# EAGLE board TDAR_VER_88 (EAGLE 6.5.0), part 1 of 2
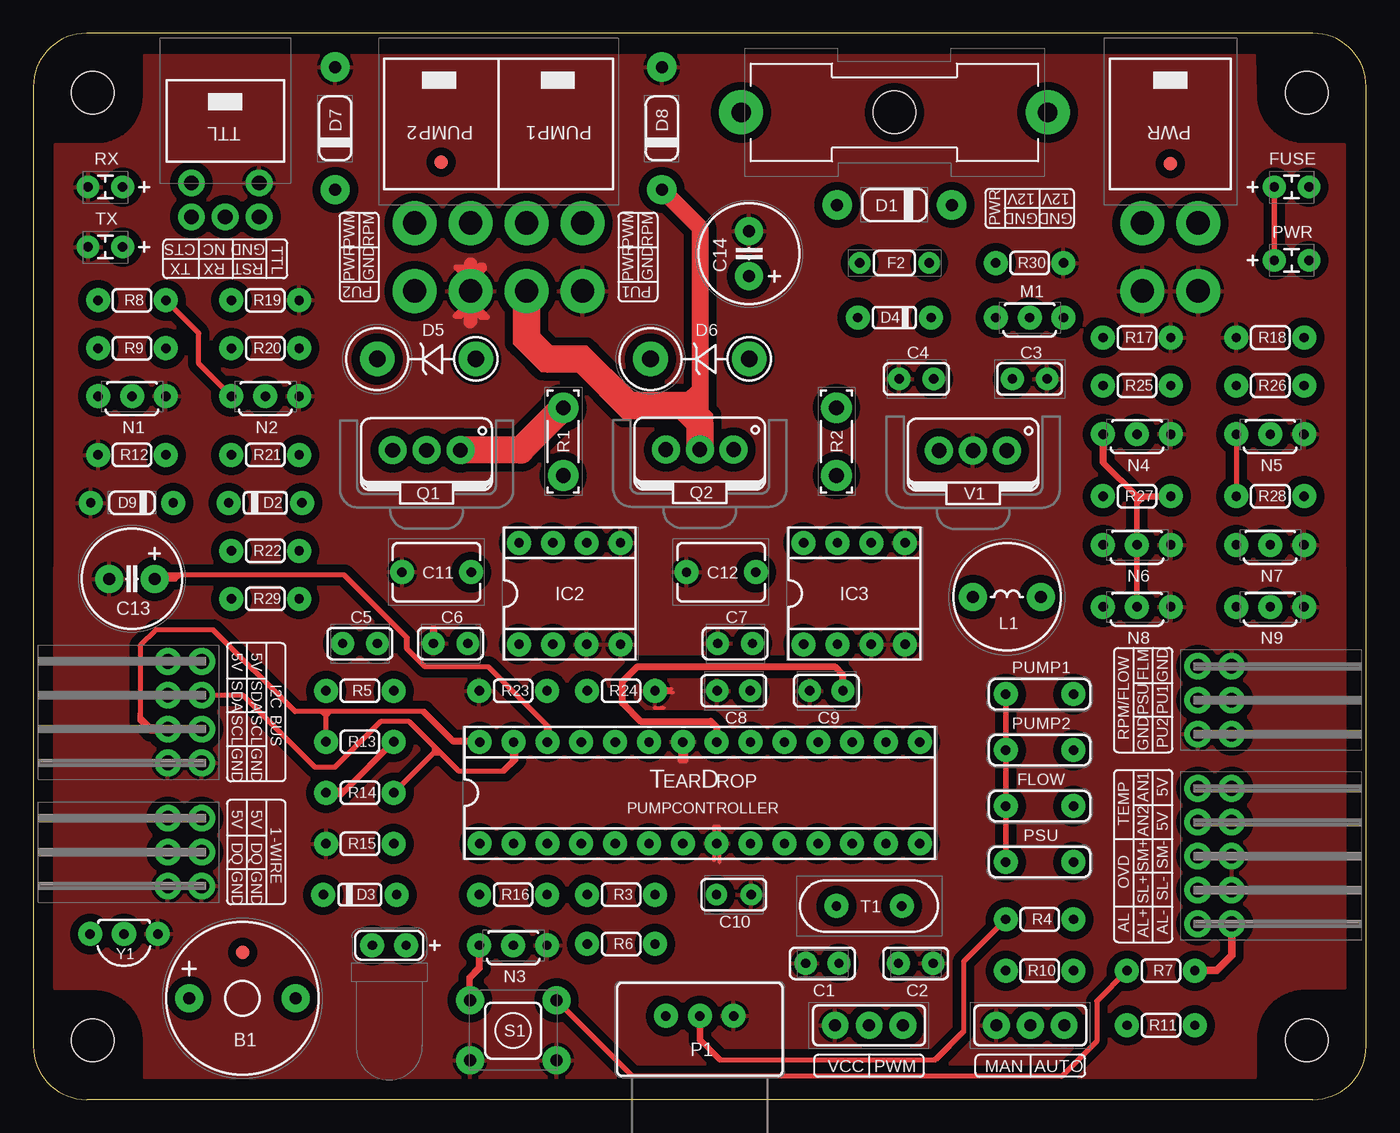
[diagram p1: board, top side]
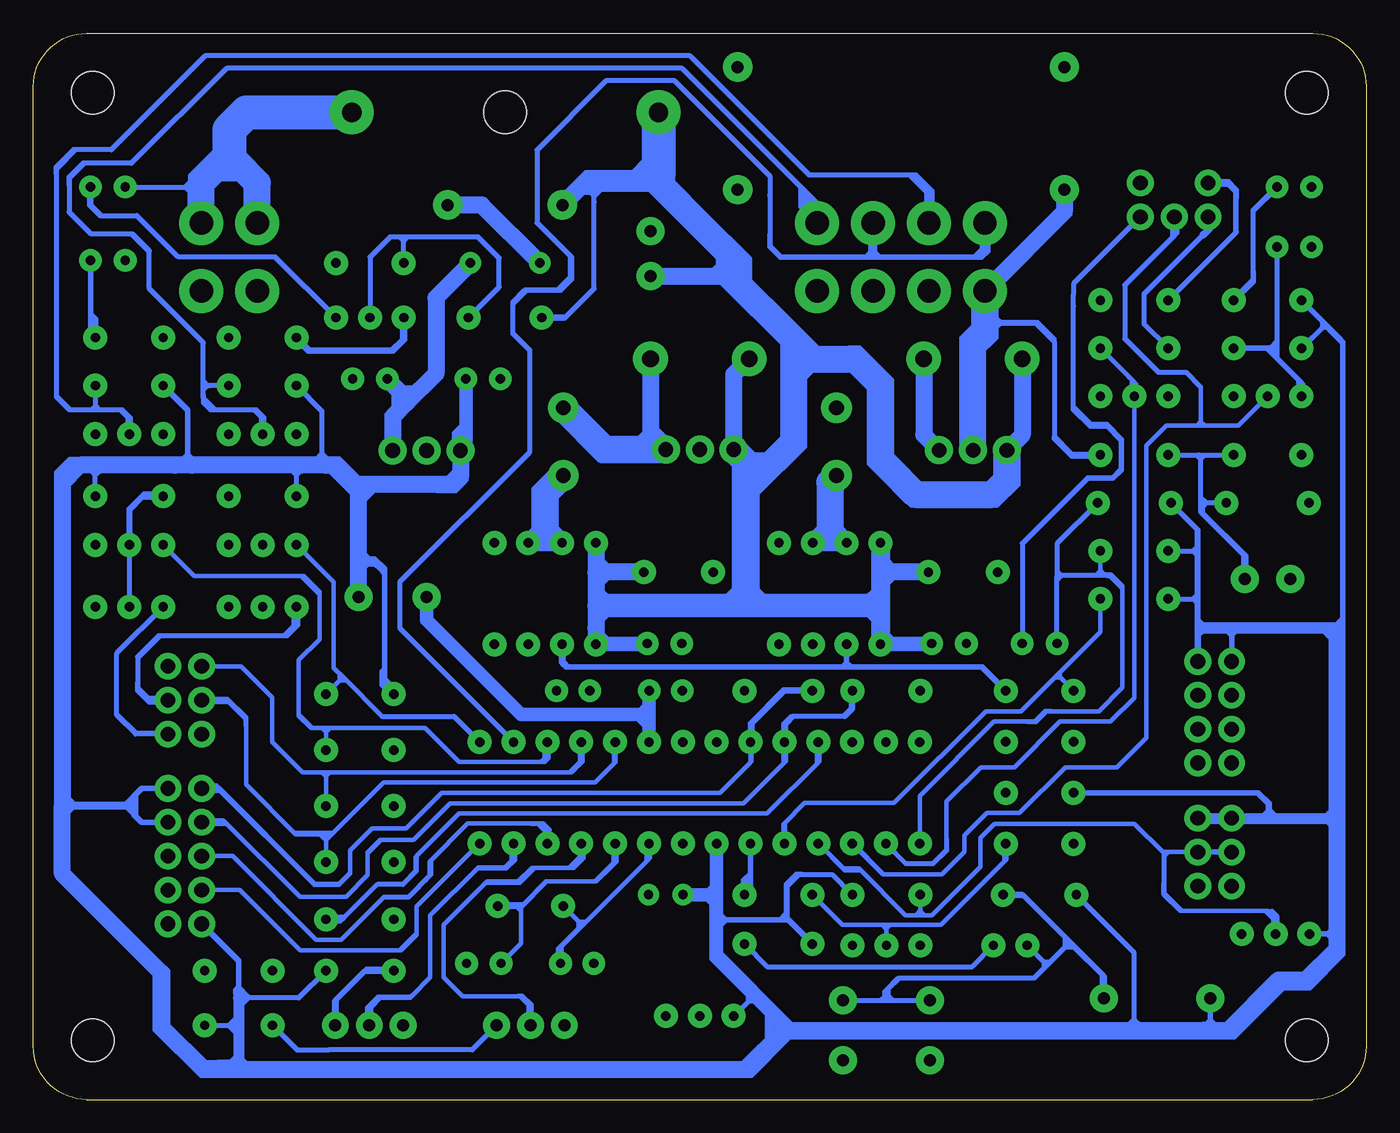
[diagram p2: board, bottom side, seen from below]

Size 100 x 80.01 mm. Coordinates in mm from the lower left corner, seen from the top.
Copper layers (1*16): Top 0.035mm / dielectric 1.5mm / Bottom 0.035mm
Design rules "ITEADstudio_DRC *": minimum track width 6mil, minimum drill 12mil, track to track 12mil, track to pad 12mil, pad to pad 12mil, via to via 12mil, smd to smd 0mil, copper to edge 12mil, drill to drill 12mil, minimum pad ring 10mil, minimum via ring 6mil, stop-mask expansion 2mil, vias tented up to drill 100mil, thermal gap 10mil
Net classes: 0 default: clearance 0.355 mm

## Footprints (pad centres in the part's own frame; a part is rotated, then mirrored left to right if it is on the bottom)
F/TMB = drill 0.9 pad 2.1: + -4,0; - 4,0
MLCC_CERAMIC_12 = drill 0.7 pad 1.7: 1 1.24,0; 2 -1.24,0
MLCC_CERAMIC_11 = drill 0.7 pad 1.7: 1 -1.3,0; 2 1.3,0
MLCC_CERAMIC_8 = drill 0.7 pad 1.7: 1 -1.3,0; 2 1.3,0
MLCC_CERAMIC = drill 0.7 pad 1.7: 1 -1.3,0; 2 1.3,0
MLCC_CERAMIC_7 = drill 0.7 pad 1.7: 1 1.24,0; 2 -1.24,0
MLCC_CERAMIC_6 = drill 0.7 pad 1.6: 1 -1.3,0; 2 1.3,0
WIMA_CAPACITOR = drill 0.7 pad 1.8: 1 -2.6,0; 2 2.6,0
E5-10,5 = drill 0.9 pad 2.1: + -1.7,0; - 1.7,0
UF4004 = drill 0.9 pad 2.2: A 4.3,0; C -4.3,0
DO35-7 = drill 0.7 pad 1.8: A 2.75,0; C -2.75,0
1N4148 = drill 0.7 pad 1.8: A -2.75,0; C 2.75,0
1N4148_2 = drill 0.7 pad 1.8: A -2.75,0; C 2.75,0
TVS_DIODE = drill 1.25 pad 2.6: A 3.7,0; C -3.7,0
UF4004_2 = drill 0.9 pad 2.2: A 4.6,0; C -4.6,0
DO34Z7 = drill 0.7 pad 1.8: A 3.1,0; C -3.1,0
LED_5_HORIZONTAL = drill 0.7 pad 1.8: A 1.27,0; K -1.27,0
FUSE_GLASS = drill 1.45 pad 3.3: 1 11.5,0; 2 -11.5,0 | hole 3.2: 0,0
PTC = drill 0.7 pad 1.6: 1 -2.6,0; 2 2.6,0
FIDUCIAL-1X2 = smd 1 x 1: 1 0,0
RESISTOR_SOCKET_TOP = drill 0.7 pad 1.8: 1 -2.54,0; 2 2.54,0
LED_1.8_LEFT = drill 0.7 pad 1.7: A -1.3,0; K 1.3,0
IO_GENERAL_4 = drill 1.1 pad 2: 5V_1 3.81,5.08; 5V_2 3.81,2.54; ALARM_LED+ 1.27,-5.08; ALARM_LED- 3.81,-5.08; SYSTEM_LED+ 1.27,-2.54; SYSTEM_LED- 3.81,-2.54; SYSTEM_MODE+ 1.27,0; SYSTEM_MODE- 3.81,0; TEMP_AN1 1.27,5.08; TEMP_AN2 1.27,2.54
I0_ONE-WIRE = drill 1.1 pad 2: 5V_1 -1.27,2.54; 5V_2 -3.81,2.54; DQ_1 -1.27,0; DQ_2 -3.81,0; GND_1 -1.27,-2.54; GND_2 -3.81,-2.54
IO_I2C = drill 1.1 pad 2: 5V_1 -1.27,3.81; 5V_2 -3.81,3.81; GND_1 -1.27,-3.81; GND_2 -3.81,-3.81; SCL_1 -1.27,-1.27; SCL_2 -3.81,-1.27; SDA_1 -1.27,1.27; SDA_2 -3.81,1.27
IO_SENSOR_4 = drill 1.1 pad 2: FLOW_A 1.27,2.54; FLOW_B 3.81,2.54; GND 1.27,-2.54; PSU 1.27,0; PUMP_1 3.81,0; PUMP_2 3.81,-2.54
TTL_USB_7 = drill 1.1 pad 2: CTS -2.54,3.81; GND 2.54,3.81; RST 2.54,1.27; RX 0,1.27; TX -2.54,1.27
ATMEGA328P = drill 0.7 pad 1.8: 1 -16.51,-3.81; 2 -13.97,-3.81; 3 -11.43,-3.81; 4 -8.89,-3.81; 5 -6.35,-3.81; 6 -3.81,-3.81; 7 -1.27,-3.81; 8 1.27,-3.81; 9 3.81,-3.81; 10 6.35,-3.81; 11 8.89,-3.81; 12 11.43,-3.81; 13 13.97,-3.81; 14 16.51,-3.81; 15 16.51,3.81; 16 13.97,3.81; 17 11.43,3.81; 18 8.89,3.81; 19 6.35,3.81; 20 3.81,3.81; 21 1.27,3.81; 22 -1.27,3.81; 23 -3.81,3.81; 24 -6.35,3.81; 25 -8.89,3.81; 26 -11.43,3.81; 27 -13.97,3.81; 28 -16.51,3.81
TC4420 = drill 0.7 pad 1.8: 1 -3.81,-3.81; 2 -1.27,-3.81; 3 1.27,-3.81; 4 3.81,-3.81; 5 3.81,3.81; 6 1.27,3.81; 7 -1.27,3.81; 8 -3.81,3.81
IRF24 = drill 0.9 pad 2.1: 1 -2.54,0; 2 2.54,0
ZVP2106A = drill 0.7 pad 1.8: D -2.54,0; G 0,0; S 2.54,0
ZVN2106A = drill 0.7 pad 1.8: D -2.54,0; G 0,0; S 2.54,0
POTENTIMETER_SQUARE = drill 0.7 pad 1.8: 1 -2.54,3.65; 2 0,3.65; 3 2.54,3.65
DP10080_V1 = hole 3.2: 5.25,76.185; 96.35,5.075; 5.25,5.075; 96.35,76.185
MOLEX_4PIN_2 = drill 1.75 pad 3.3: 1 2.1,-9; 2 -2.1,-9; 3 2.1,-14.1; 4 -2.1,-14.1
MOLEX_POWER_8_PIN_HORIZONTAL_2 = drill 1.75 pad 3.3: 12V_A -6.3,-14.1; 12V_B 2.1,-14.1; GND_A -2.1,-14.1; GND_B 6.3,-14.1; PWM_A -6.3,-9; PWM_B 2.1,-9; TACH_A -2.1,-9; TACH_B 6.3,-9
IRF5210 = drill 1.1 pad 2.1: D 0,4.3; G 2.54,4.3; S -2.54,4.3
V234/12 = drill 1.1 pad 2.3: 1 -2.54,0; 2 2.54,0
0204/5 = drill 0.7 pad 1.8: 1 -2.54,0; 2 2.54,0
LED_1.8_RIGHT = drill 0.7 pad 1.7: A 1.3,0; K -1.3,0
MOM_SWITCH_6.0 = drill 0.9 pad 2.1: 1 -3.25,-2.25; 2 3.25,-2.25; 3 -3.25,2.25; 4 3.25,2.25
SLIDING_SWITCH_5 = drill 0.9 pad 2: 1 0,0; 2 -2.54,0; 3 2.54,0
SLIDING_SWITCH_4 = drill 0.9 pad 2: 1 0,0; 2 -2.54,0; 3 2.54,0
CRYSTAL_16MHZ = drill 0.7 pad 1.8: 1 -2.45,0; 2 2.45,0
LM7805 = drill 1.1 pad 2.1: GND 0,4.3; VI 2.54,4.3; VO -2.54,4.3
DS18B20 = drill 0.7 pad 1.8: D 0,0; G -2.54,0; V 2.54,0

## Placement (x,y rotation side)
B1  (12V, 30mA, 2300Hz)  [F/TMB]  15.69,7.61 0 top
C1  22pF/50V  [MLCC_CERAMIC_12]  59.2,10.22 0 top
C2  22pF/50V  [MLCC_CERAMIC_11]  66.2,10.22 0 top
C3  470nF/25V  [MLCC_CERAMIC_8]  74.75,54.08 0 top
C4  100nF/25V  [MLCC_CERAMIC]  66.25,54.08 0 top
C5  100nF/25V  [MLCC_CERAMIC]  24.5,34.23 0 top
C6  100nF/25V  [MLCC_CERAMIC]  31.3,34.23 0 top
C7  100nF/25V  [MLCC_CERAMIC]  52.65,34.23 0 top
C8  100nF/25V  [MLCC_CERAMIC_7]  52.55,30.68 0 top
C9  100nF/25V  [MLCC_CERAMIC_7]  59.5,30.68 0 top
C10  100nF / 25V  [MLCC_CERAMIC_6]  52.55,15.38 0 top
C11  (MKS2B042201F00JSSD)  [WIMA_CAPACITOR]  30.25,39.58 180 top
C12  (MKS2B042201F00JSSD)  [WIMA_CAPACITOR]  51.6,39.58 180 top
C13  100uF/50V  [E5-10,5]  7.4,39.08 180 top
C14  470uF/35V  [E5-10,5]  53.7,63.47 90 top
D1  1N4007  [UF4004]  64.6,67.12 180 top
D2  1N4148  [DO35-7]  17.4,44.77 0 top
D3  1N4148  [1N4148]  24.5,15.38 180 top
D4  1N4148_2  [1N4148_2]  64.6,58.67 0 top
D5  ICTE12-E3/51  [TVS_DIODE]  29.5,55.58 0 top
D6  ICTE12-E3/51  [TVS_DIODE]  50,55.58 0 top
D7  UF4004  [UF4004_2]  22.65,72.88 90 top
D8  UF4004  [UF4004_2]  47.15,72.88 90 top
D9  BZX79-B/C5V1  [DO34Z7]  7.4,44.77 180 top
E1  RED  [LED_5_HORIZONTAL]  26.7,11.57 0 top
F1  6.3A  [FUSE_GLASS]  64.6,74.08 0 top
F2  0.5A/60V  [PTC]  64.6,62.77 0 top
FID1  FIDUCIAL1X2  [FIDUCIAL-1X2]  85.3,70.24 0 top
FID2  FIDUCIAL1X2  [FIDUCIAL-1X2]  15.69,11.07 0 top
FID3  FIDUCIAL1X2  [FIDUCIAL-1X2]  30.59,70.35 0 top
FLOW  10K/0.5W  [RESISTOR_SOCKET_TOP]  75.5,22.02 0 top
FUSE  RED  [LED_1.8_LEFT]  94.4,68.47 0 top
I/O_1  IO_SENSOR  [IO_GENERAL_4]  86.1,18.27 0 top
I/O_2  IO_ONE-WIRE  [I0_ONE-WIRE]  13.9,18.57 0 top
I/O_3  IO_I2C  [IO_I2C]  13.9,29.07 0 top
I/O_4  IO_METER  [IO_SENSOR_4]  86.1,29.98 0 top
I/O_5  TTL_USB  [TTL_USB_7]  14.4,64.97 0 top
IC1  ATMEGA328P  [ATMEGA328P]  50,23.02 0 top
IC2  MIC4421  [TC4420]  40.25,37.98 0 top
IC3  MIC4421  [TC4420]  61.6,37.98 0 top
L1  10uH/4.7A  [IRF24]  73.05,37.73 0 top
M1  ZVP2106A  [ZVP2106A]  74.75,58.67 0 top
N1  ZVN2106A  [ZVN2106A]  7.4,52.77 0 top
N2  ZVN2106A  [ZVN2106A]  17.4,52.77 0 top
N3  ZVN2106A  [ZVN2106A]  36,11.57 0 top
N4  ZVN2106A  [ZVN2106A]  82.8,49.92 0 top
N5  ZVN2106A  [ZVN2106A]  92.8,49.92 0 top
N6  ZVN2106A  [ZVN2106A]  82.8,41.62 0 top
N7  ZVN2106A  [ZVN2106A]  92.8,41.62 0 top
N8  ZVN2106A  [ZVN2106A]  82.8,36.98 0 top
N9  ZVN2106A  [ZVN2106A]  92.8,36.98 0 top
P1  10K  [POTENTIMETER_SQUARE]  50,2.62 0 top
PCB1  80X100mm  [DP10080_V1]  -0.8,-0.62 0 top
POWER  4-PIN MOLEX  [MOLEX_4PIN_2]  85.3,74.78 0 top
PSU  10K/0.5W  [RESISTOR_SOCKET_TOP]  75.5,17.82 0 top
PUMP1  10K/0.5W  [RESISTOR_SOCKET_TOP]  75.5,30.43 0 top
PUMP2  10K/0.5W  [RESISTOR_SOCKET_TOP]  75.5,26.23 0 top
PUMP_2  PUMP2  [MOLEX_POWER_8_PIN_HORIZONTAL_2]  34.9,74.78 0 top
PWR  GREEN  [LED_1.8_LEFT]  94.4,62.98 0 top
Q1  IRF5210PBF  [IRF5210]  29.5,44.42 0 top
Q2  IRF5210PBF  [IRF5210]  50,44.48 0 top
R1  100R/15W  [V234/12]  39.75,49.38 270 top
R2  100R/15W  [V234/12]  60.25,49.38 270 top
R3  470R/0.5W  [0204/5]  44.1,15.38 0 top
R4  470R/0.5W  [0204/5]  75.5,13.53 0 top
R5  560R/0.5W  [0204/5]  24.5,30.68 0 top
R6  560R/0.5W  [0204/5]  44.1,11.68 0 top
R7  560R/0.5W  [0204/5]  84.6,9.68 0 top
R8  1K/0.5W  [0204/5]  7.4,59.98 0 top
R9  1K/0.5W  [0204/5]  7.4,56.38 0 top
R10  1K/0.5W  [0204/5]  75.5,9.68 0 top
R11  1K/0.5W  [0204/5]  84.6,5.58 0 top
R12  4K7/0.5W  [0204/5]  7.4,48.38 0 top
R13  4K7/0.5W  [0204/5]  24.5,26.85 0 top
R14  4K7/0.5W  [0204/5]  24.5,23.02 0 top
R15  4K7/0.5W  [0204/5]  24.5,19.2 0 top
R16  4K7/0.5W  [0204/5]  36,15.38 0 top
R17  4K7/0.5W  [0204/5]  82.8,57.17 0 top
R18  4K7/0.5W  [0204/5]  92.8,57.17 0 top
R19  10K/0.5W  [0204/5]  17.4,59.98 0 top
R20  10K/0.5W  [0204/5]  17.4,56.38 0 top
R21  10K/0.5W  [0204/5]  17.4,48.38 0 top
R22  10K/0.5W  [0204/5]  17.4,41.17 0 top
R23  10K/0.5W  [0204/5]  36,30.68 0 top
R24  10K/0.5W  [0204/5]  44.1,30.68 0 top
R25  10K/0.5W  [0204/5]  82.8,53.58 0 top
R26  10K/0.5W  [0204/5]  92.8,53.58 0 top
R27  10K/0.5W  [0204/5]  82.8,45.27 0 top
R28  10K/0.5W  [0204/5]  92.8,45.27 0 top
R29  270K/0.5W  [0204/5]  17.4,37.58 0 top
R30  270K/0.5W  [0204/5]  74.75,62.77 0 top
RX  ORANGE  [LED_1.8_RIGHT]  5.4,68.47 0 top
S1  MOMENTARY  [MOM_SWITCH_6.0]  36,5.21 0 top
S2  LATCHING  [SLIDING_SWITCH_5]  62.7,5.58 0 top
S3  LATCHING SWITCH  [SLIDING_SWITCH_4]  74.8,5.58 0 top
T1  16MHZ  [CRYSTAL_16MHZ]  62.7,14.53 0 top
TX  YELLOW  [LED_1.8_RIGHT]  5.4,63.97 0 top
U$1  TDPC_LOGO  [TDPC_LOGO]  50,20.77 0 top
U$2  MOLEX_4PIN_LEGEND  [MOLEX_4PIN_LEGEND]  74.75,66.88 0 top
V1  LM7805ACT  [LM7805]  70.5,44.41 0 top
Y1  DS18B20  [DS18B20]  6.8,12.43 180 top

## Tracks (layer width: path | path; a pad name or v marks a point on that pad's centre or on a via)
5V
  Top 0.254: 22.12,23.09 22.37,22.84 23.18,22.84 27.15,26.82 27.15,26.91 27.11,26.95 | 27.11,26.95 26.97,26.95 23.31,23.29 22.04,23.29 21.86,23.11 21.86,22.98 | R13.2 27.04,26.88 27.11,26.95 | R14.1 21.89,23.02 22.15,23.28 | 22.15,23.28 23.27,23.28 | 23.43,23.28 23.46,23.25 23.46,23.17 23.13,22.84 22,22.84 21.87,22.98 21.87,23.09 | 21.87,23.09 22.05,23.28 22.15,23.28 | 21.87,23.09 21.89,23.09 R14.1
  Top 0.406: R14.1 23.21,23.02 R13.2 | PSU.1 FLOW.1 PUMP2.1 PUMP1.1
  Bottom 0.254: 88.04,48.08 88.31,48.34 88.57,48.34 | 88.28,48.08 88.04,48.08 | 77.89,48.01 77.92,48.01 78.27,48.35 78.45,48.35 78.73,48.08 | 78.36,47.89 78.55,48.08 78.73,48.08 | 79.82,47.09 79.94,47.09 | 79.94,47.09 80.23,46.8 80.3,46.8 80.57,47.08 | 79.94,47.09 80.06,47.22 80.26,47.22 | 74.36,46.05 75.31,45.09 75.77,45.09 77.92,47.24 77.92,47.27 77.83,47.35 77.83,47.71 | 77.23,48.1 77.69,48.1 77.83,47.97 77.83,47.71 | 77.23,48.1 75.73,46.6 | 77.23,48.1 77.24,48.12 | 77.24,48.12 88.06,48.12 | 77.83,47.71 77.94,47.6 | 70.23,46.16 69.72,45.65 68.28,45.65 67.45,46.48 67.45,48.23 | 69.09,46.53 68.27,47.35 67.81,47.35 67.96,47.2 67.96,46.73 | 75.01,46.52 75.62,46.52 77.21,48.12 | 77.25,48.12 77.22,48.12 77.21,48.12 | 77.25,48.12 78.45,48.12 78.45,48.1 | 77.21,48.12 77.21,48.1 | 77.24,48.12 77.25,48.12 | 97.83,24 97.63,24 97.47,24.16 97.47,22.52 97.53,22.46 97.53,22.7 97.53,22.71 97.39,22.71 96.82,22.14 96.82,22.04 97.53,21.32 97.81,21.32 | 87.47,47.99 88.07,47.99 | 88.07,47.99 88.14,47.92 87.73,47.92 87.51,47.7 | 87.89,47.92 88.04,48.08 | 88.43,48.51 89.34,47.6 89.37,47.6 | 87.92,48.02 88.35,48.45 88.4,48.45 88.4,48.31 88.41,48.3 | 45.87,7.45 45.93,7.51 | 45.93,7.51 46,7.57 46,7.85 | 46.48,8.1 46.31,8.27 46.22,8.27 46.18,8.22 | 48.87,11.15 49.02,11.15 48.84,10.97 48.73,10.97 | 48.73,11.8 48.9,11.63 49.02,11.76 | 48.62,13.88 48.42,13.88 48.08,13.54 | 48.08,13.54 48.08,13.43 48.39,13.12 | 48.08,13.54 48.2,13.54 48.23,13.51 48.23,13.47 | 11.44,5.62 11.44,5.43 11.6,5.43 11.89,5.72 11.95,5.72 11.99,5.77 | 17.19,5.69 16.88,5.38 16.81,5.38 | 17.19,5.69 17.4,5.91 17.45,5.91 17.84,5.53 | 17.43,5.63 17.25,5.63 17.19,5.69
  Bottom 0.254: 2.29,12.96 2.49,12.96 3.01,12.44 3.01,12.39 2.56,11.95 2.52,11.95 2.43,12.04 2.49,12.09 | 77.6,2.71 77.67,2.71 77.67,2.54 77.94,2.27 | 43.85,13.48 43.92,13.48 43.91,13.47 43.91,13.45 | 43.85,13.48 43.53,13.8 | 43.46,13.47 43.47,13.48 43.85,13.48 | 2.16,35.4 2.19,35.37 2.4,35.37 | 2.03,34.12 1.82,34.12 1.7,34.01 | 1.68,56.43 1.68,34.01 1.7,34.01 | 1.68,56.43 1.68,56.77 | 1.94,35.67 2.02,35.67 | 2.02,35.67 12.54,35.67 | 12.67,35.27 12.49,35.09 2.4,35.09 2.68,34.81 | 2.68,34.81 2.68,35.27 2.62,35.33 3.03,35.33 3.2,35.16 | 3.2,35.16 3.06,35.16 2.57,34.66 | 2.68,34.56 3.03,34.91 | 3.03,34.91 3.23,35.12 | 3.2,35.16 3.03,34.98 3.03,34.91 | 2.69,34.69 2.56,34.81 2.49,34.75 2.4,34.75 | 2.77,57.83 2.85,57.91 3.23,57.91 | 3.23,57.91 3.16,57.98 | 3.16,57.98 3.16,58.27 | 3.41,58.53 3.41,58.55 3.35,58.49 3.35,58.02 | 3.35,58.02 3.35,57.87 | 3.16,58.27 | 3.16,58.27 3.16,58.28 | 2.02,35.67 2.02,35.62 1.97,35.62 1.93,35.66 1.93,36.02 1.75,36.2 1.76,36.2 2.53,35.44 2.53,35.37 2.4,35.37 | 3.16,57.98 3.03,58.1 3.03,58.15 | 3.23,57.91 3.35,58.02 | 9.59,35.17 9.68,35.17 10.06,34.8 10.15,34.8 10.44,35.09 12.31,35.09 12.59,34.8 | 12.59,34.8 12.59,35.63 12.71,35.76 12.71,35.88 | 12.71,35.88 12.71,36.06 12.67,36.1 12.67,36.02 12.28,35.62 | 12.66,37.99 12.98,37.67 | 12.98,37.67 12.98,37.48 12.74,37.23 | 12.98,37.67 12.96,37.66 12.88,37.66 12.88,37.58 | 12.69,41.6 12.69,41.55 13.03,41.2 13.03,41.12 12.88,40.97 | 12.88,40.97 12.75,40.84 | 12.67,41.09 12.79,40.97 12.88,40.97 | 44.02,5.62 44.15,5.62 44.75,6.21 44.8,6.17 | 44.02,5.62 43.86,5.62 43.82,5.66 43.82,5.75 44.47,6.41 44.47,6.74 43.27,5.54 43.01,5.54 43.01,5.58 43.2,5.78
  Bottom 0.254: 44.02,5.62 44.57,6.17 | 44.8,6.17 44.92,6.04 44.92,5.72 | 2.18,34.1 2.21,34.08 2.3,34.08 1.96,34.41 1.96,34.47 | 2.4,34.75 2.17,34.75 2.17,35.04 | 2.36,32.63 2.68,32.95 2.68,34.56 | 2.68,34.56 2.68,34.81 | 2.66,21.73 2.99,21.39 2.99,20.86 2.54,20.41 2.37,20.41 2.41,20.45 2.41,20.46 2.18,20.46 | 6.95,21.23 6.95,21.39 | 7.26,21.7 7.32,21.7 7.36,21.66 | 7.26,21.7 7.28,21.73 7.28,21.95 | 45.33,7.45 44.87,7.45 43.2,5.78 | 95.64,47.76 95.99,48.1 97.31,48.1 | 98.33,45.97 98.14,46.16 98.14,46.27 | 98.14,46.27 98.14,47.02 97.24,47.92 96.84,47.92 | 97.83,46.27 98.14,46.27 | 98.03,45.58 98.33,45.88 98.33,45.97 | 98.33,45.97 98.33,47.09 97.31,48.1 | 97.31,48.1 97.31,48.11 95.9,48.11 97.9,46.1 98.12,46.1 98.34,46.33 98.34,47.07 98.13,47.28 | 95.39,46.81 95.32,46.81 94.94,47.2 94.94,47.32 95.12,47.51 | 95.39,46.81 95.67,47.08 | 88.41,47.95 88.41,47.91 88.12,47.62 | 88.07,47.99 88.07,47.66 | 88.07,47.66 88.12,47.62 | 88.12,47.62 88.1,47.6 | 88.04,48.08 88.04,47.7 88.07,47.66 | 2.11,33.87 2.24,34 | 2.24,34 2.61,34 2.68,34.08 2.68,34.53 2.5,34.71 1.8,34.71 2.04,34.95 2.5,34.95 2.42,35.04 2.17,35.04 | 2.17,35.04 1.99,35.04 | 1.68,35.41 1.68,36.13 1.76,36.13 | 2.4,35.56 1.83,36.13 1.76,36.13 | 2.4,35.37 2.4,35.39 | 1.76,34.97 2.4,34.97 | 2.4,34.97 2.4,35.37 | 2.4,34.75 2.4,34.97 | 2.17,35.08 2.17,35.04 | 2.68,34.56 2.4,34.56 2.4,34.75 | 2.24,34 1.7,34 1.7,34.01 | 1.76,36.13 1.76,36.06 | 1.76,56.5 1.68,56.58 1.68,56.78 | 1.67,56.88 1.67,56.68 1.8,56.56 1.68,56.43 | 1.67,56.88 2.33,57.53 2.58,57.53 3.01,57.97 | 4.65,56.67 4.46,56.67 3.25,57.88 3.2,57.88 | 3.2,57.88 2.94,57.88 1.83,56.76 | 3.23,57.91 3.2,57.88 | 4.57,8.46 6.37,8.46 10.14,4.7 12.13,4.7 12.81,5.38 16.7,5.38 16.81,5.38
  Bottom 0.254: 1.67,56.87 1.67,11.1 4.31,8.46 4.57,8.46 | 1.67,56.87 1.9,57.1 | 1.67,56.88 1.67,56.87 | 46.05,7.85 46,7.85 | 46,7.85 45.27,7.85 43.2,5.78 | 43.03,5.6 43.2,5.78 | 43.2,5.78 | 12.66,33.11 12.71,33.11 12.73,33.13 12.73,34.69 12.63,34.79 12.6,34.79 12.59,34.8 | 94.55,47.42 94.66,47.42 95.15,46.92 | 95.15,46.92 95.36,46.72 | 95.39,46.81 95.28,46.92 95.15,46.92 | 46.32,8.04 46.36,8 46.36,7.42 46.34,7.4 | 46.34,7.4 45.86,7.4 45.93,7.47 45.93,7.51 | 48.96,11.22 48.99,11.22 48.84,11.38 48.76,11.38 | 49.11,10.62 49.11,11.51 48.96,11.66 49.02,11.72 49.02,11.76 | 49.11,10.62 44.73,6.24 44.73,6.21 44.77,6.17 44.8,6.17 | 48.76,11.38 48.73,11.38 | 43.67,13.51 43.59,13.43 43.21,13.43 43.4,13.62 43.4,13.82 43.49,13.92 43.49,13.99 43.95,13.53 43.99,13.53 43.91,13.45 | 43.91,13.45 43.66,13.45 | 8.32,22.98 8.27,23.02 8.34,23.09 | 8.75,23.01 8.67,23.09 8.34,23.09 | 8.34,23.09 8.2,23.09 | 6.97,21.47 7.21,21.7 7.26,21.7 | 49.03,14.64 49.45,15.06 49.45,15.71 49.03,16.13 48.88,16.13 48.73,15.98 48.73,15.56 | 11.11,5.43 11.11,5.5 11.64,6.02 11.74,6.02 11.99,5.77 | 11.99,5.77 12.08,5.68 | 75.28,39.57 75.28,39.73 74.88,40.13 74.38,40.13 74.01,39.77 | 74.01,39.77 73.71,39.46 | 73.68,38.48 73.58,38.58 73.58,39.88 73.65,39.96 | 73.65,39.96 74.34,40.65 74.77,40.65 75.14,41.02 | 74.01,39.77 73.65,39.77 73.65,39.96 | 91.99,23.23 92.23,22.99 | 92.23,22.99 92.23,21.31 92.87,21.95 92.89,21.95 92.89,22.23 92.48,22.64 92.45,22.61 92.45,22.09 | 91.91,20.96 92.1,20.96 93.1,21.96 93.1,22.21 92.38,22.93 92.29,22.93 92.23,22.99 | 44.89,4.53 44.98,4.62 44.98,6.66 44.8,6.47 44.8,4.94 44.57,5.16 44.57,6.47 44.69,6.36 44.78,6.36 44.3,5.88 44.3,5.66 49.17,10.53 49.17,11.61
  Bottom 0.254: 49.17,11.61 49.17,14.65 49.89,15.37 | 49.02,11.76 49.02,12.19 | 49.11,10.62 48.85,10.87 48.85,11.61 49.17,11.61 | 41.79,5.4 42.77,5.4 48.76,11.39 48.76,11.38 | 48.76,11.35 48.76,11.38 | 45.8,7.43 45.9,7.33 46.3,7.33 | 46.3,7.33 46.42,7.45 46.42,7.85 | 46.34,7.4 46.3,7.36 46.3,7.33 | 41.94,16.84 42.21,16.84 42.33,16.96 42.77,16.96 43.56,16.17 43.56,14 44.03,13.52 43.36,13.52 | 43.36,13.52 43.31,13.47 | 43.36,13.52 43.39,13.55 43.39,16.09 42.67,16.81 | 1.9,12.2 1.67,11.97 1.67,10.86 4.2,8.33 4.7,8.33 | 4.7,8.33 6.19,8.33 9.86,4.66 43.98,4.66 44.09,4.77 | 4.57,8.46 4.7,8.33 | 50.3,2.22 49.84,1.76 46.6,1.76 | 46.6,1.76 46.09,1.76 43.26,4.59 | 46.6,2.27 46.47,2.41 46.47,1.9 46.6,1.76 | 75.41,44.63 75.41,44.65 74.35,45.7 74.58,45.7 77.01,48.14 78.42,48.14 78.45,48.1 | 78.45,48.1 78.52,48.03 | 77.72,47.73 77.72,47.91 78.27,48.46 78.45,48.46 78.83,48.08 78.82,48.08 78.73,48.08 | 73.65,31.12 73.63,31.1 73.61,31.1 | 72.91,30.35 72.91,30.4 72.77,30.54 72.77,30.82 73.59,31.63 73.59,31.35 72.78,30.54 72.78,30.35 72.88,30.25 73.06,30.25 73.19,30.38 | 73.19,30.38 73.9,31.09 73.9,32.17 73.71,32.36 | PUMP1.1 73,30.38 73.19,30.38 | 48.65,13 48.42,13 48.12,13.29 | 48.12,13.29 48.01,13.41 48.01,13.53 48.45,13.98 | 48.08,13.54 48.12,13.5 48.12,13.29 | 8.17,21.14 7.93,21.14 7.32,21.75 7.32,21.95 7.22,22.05 7.22,22.23 | 7.22,22.23 8.06,23.08 9.05,23.08 8.97,23 8.22,23 7.36,22.14 7.36,21.66 | 7.36,21.66 7.36,21.22 | 11.52,35.35 11.94,35.35 12.57,35.97 12.57,42.77 14.45,44.66 14.57,44.66 14.57,44.6 12.73,42.77 12.73,34.88 | 12.73,34.88 12.73,32.87 12.68,32.82 12.6,32.82 12.52,32.9 12.52,34.81 12.2,35.13
  Bottom 0.254: 12.59,34.8 12.66,34.8 12.73,34.88 | 11.94,35.52 12.05,35.52 12.62,36.09 12.62,35.97 12.71,35.88 | 6.57,21.04 6.57,21.13 7.21,21.77 7.21,22.22 | 7.21,22.22 7.21,22.25 8.05,23.1 21.98,23.1 22.05,23.03 22.05,23.01 22,22.95 8.22,22.95 7.4,22.14 7.4,21.71 7.86,21.26 7.94,21.26 | 7.22,22.23 7.21,22.22 | 84.2,2.27 84.15,2.32 84.12,2.32 83.97,2.47 83.84,2.47 83.84,2.62 84.6,3.37 84.73,3.37 86.36,1.75 87.45,1.75 90.92,5.21 90.92,9.55 91.34,9.97 | 86.44,2.34 86.43,2.35 86.2,2.35 | 91.76,10.87 91.05,10.87 89.83,9.65 89.83,5.63 86.91,2.71 87.2,2.42 87.2,2.35 | 68.19,48.43 68.05,48.28 68.05,48.25 68.03,48.24 67.98,48.24 67.45,48.77 67.45,49.46 67.17,49.74 | 68.19,48.43 68.47,48.7 68.47,50.06 67.86,50.67 67.86,50.37 68.22,50.01 68.22,49.3 68.27,49.26 68.23,49.26 68.07,49.42 68.07,50.07 68.11,50.1 | 68.19,48.43 67.96,48.66 V1.VO 67.96,50.2 67.55,50.62 | 67.17,49.74 67.17,51.34 67.37,51.14 67.37,49.73 67.62,49.48 67.62,49.23 67.59,49.27 67.59,50.18 67.65,50.11 67.8,50.11 67.81,50.1 67.81,49.25 67.64,49.09 67.64,48.69 67.17,49.16 67.17,49.38 | 67.17,49.38 67.17,49.74 | 67.86,48.73 67.4,49.2 67.37,49.2 67.4,49.22 67.4,49.5 67.29,49.5 67.17,49.38 | 17.89,5.65 17.48,6.06 17.39,6.06 16.81,5.49 16.81,5.38
  Bottom 0.305: 6.95,21.39 7.03,21.48 7.28,21.48
  Bottom 0.356: 7.28,21.11 7.33,21.16 9.93,21.16 9.97,21.11
  Bottom 0.381: 2.6,11.97 2.49,12.09 2.24,12.34 | 2.24,12.34 2.18,12.39 | 78.04,2.52 78.29,2.27 | R25.1 78.36,51.67 78.36,47.89 78.07,47.6 | R27.1 80.26,47.22 80.26,47.37 80.49,47.6 | 46.18,7.85 46.18,8.22 | 48.73,13.14 48.4,13.47 48.23,13.47 | R14.1 8.27,23.02 8.15,23.02 7.28,22.16 7.28,21.95 7.28,21.48 7.28,21.11 | 17.43,5.63 17.43,11.05 D3.C | 11.89,5.46 12.15,5.21 | 2.33,12.43 2.24,12.34 | R16.2 40.06,16.89 42.58,16.89 42.67,16.81 43.46,16.02 43.46,13.47 | D2.C 12.67,42.8 12.67,41.09 | 12.67,41.09 12.67,37.48 | 12.67,37.48 12.67,36.1 12.67,35.27 | 12.67,35.27 12.67,34.94 | 12.67,34.94 12.67,34.27 | R22.1 12.75,41.17 12.67,41.09 | 12.63,35.31 12.63,34.98 12.67,34.94 | 12.63,35.34 12.63,35.31 | 12.63,35.31 12.67,35.27 | R29.1 12.88,37.58 12.76,37.58 12.67,37.48 | 2.03,34.12 2.16,34.12 2.18,34.1 | R9.1 3.16,58.08 3.16,58.27 | R28.2 95.34,47.29 95.12,47.51 95.03,47.6 | R8.1 1.9,57.01 1.9,56.95 | P1.1 46.23,7.51 45.93,7.51 | 86.44,2.34 86.51,2.27 | R10.2 80.09,7.62 84.6,7.62 84.6,7.63 | R11.2 84.64,5.58 | 84.64,5.58 84.6,5.53 | 84.64,4.88 85.3,5.55 85.3,5.57 84.74,6.13 84.73,6.13 84.73,6.78 83.88,7.63 83.88,7.73 84.6,8.45 84.83,8.22 84.83,5.76 | 84.83,5.76 84.83,5.61 | 84.64,5.58 84.83,5.76
  Bottom 0.406: 88.41,47.95 88.41,48.3 88.41,51.73 R26.1 | Y1.V 2.33,12.43 | 48.23,13.47 43.46,13.47 43.36,13.47 R6.1 | I/O_3.5V_2 10.09,35.32 10.02,35.39 | I/O_3.5V_1 12.63,35.34 | 1.76,34.97 1.76,36.06 1.76,56.5 1.76,56.81 1.9,56.95 2.77,57.83 | B1.+ 11.69,5.34 | 11.8,5.21 11.69,5.31 11.69,5.34 | 11.69,5.34 11.6,5.43 | 75.59,40.5 75.52,40.43 74.32,40.43 73.65,39.77 73.65,31.12 PUMP1.1 | I/O_1.5V_2 91.85,20.82 92.45,21.41 92.45,22.09 92.45,22.75 91.85,23.36 I/O_1.5V_1 | I/O_1.ALARM_LED+ 84.6,10.43 84.6,8.04
  Bottom 0.607: 92.45,22.09 97.81,22.09 97.83,22.07
  Bottom 0.813: 12.38,35.39 10.02,35.39 2.4,35.39 2.2,35.39 | 97.64,23.5 97.83,23.7 | I/O_2.5V_1 I/O_2.5V_2 9.97,21.11 2.28,21.11 2.18,21.02 | 84.6,8.04 84.6,7.63 84.6,5.53 84.6,2.35
  Bottom 1.016: 2.26,20.61 2.18,20.7 | IC1.7 48.73,15.56 | 48.73,15.56 48.73,13.14 48.73,11.8 48.73,11.38 48.73,10.97 48.73,10.78 46.18,8.22 44.93,6.97 | 48.73,15.56 48.91,15.38 C10.1 | C4.2 67.55,50.62
  Bottom 1.27: 86.63,2.27 86.51,2.27 84.2,2.27 78.29,2.27 77.94,2.27 46.6,2.27 43.66,5.21 | 2.18,34.1 2.18,21.02 2.18,20.7 2.18,20.46 2.18,12.39 2.18,11.31 4.52,8.97 6.59,8.97 10.36,5.21 11.8,5.21 12.15,5.21 43.66,5.21 | V1.VO 67.96,46.73 68.54,46.16 70.23,46.16 75.89,46.16 | 75.89,46.16 76.04,46.16 77.48,47.6 77.94,47.6 78.07,47.6 80.49,47.6 88.1,47.6 89.37,47.6 95.03,47.6 96.51,47.6 97.83,46.27 97.83,24 97.83,23.7 97.83,22.07 97.83,16.96 90.35,9.48 90.35,5.41 87.29,2.35 87.2,2.35 86.2,2.35 84.6,2.35 | L1.2 75.59,40.5 75.59,45.85 75.89,46.16 | 43.86,5.62 43.66,5.42 43.66,5.21
12V
  Bottom 0.254: 57.79,37.08 57.6,37.08 | 57.6,37.08 57.22,37.08 | 46.54,37.92 46.57,37.89 46.57,37.08 | 60.34,67.09 60.34,67.63 58.5,69.47 | 58.5,69.47 58.35,69.62 | 58.29,69.62 54.2,69.62 | 54.2,69.62 53.6,69.62 | 56.36,68.64 57.33,68.64 57.95,68.02 58.63,68.02 58.8,68.19 58.4,68.19 | 58.23,68.19 58.05,68.19 | 58.05,68.19 58.04,68.18 | 58.4,68.19 58.24,68.03 57.95,67.75 57.95,67.62 57.92,67.66 57.92,67.73 | 57.25,69.36 57.51,69.61 58.38,69.61 | 58.38,69.61 60.68,67.32 | 60.68,67.32 60.68,67.15 | 58.35,69.62 58.38,69.62 | 58.38,69.62 58.38,69.61 | 58.05,68.11 57.76,68.4 53.8,68.4 | 58.05,68.19 58.05,68.11 | 58.05,68.11 58.08,68.08 | 48.97,64.7 47.76,64.7 46.84,63.78 46.84,62.02 | 46.84,62.02 46.98,61.88 47.47,61.88 47.8,61.88 48.2,61.88 48.35,61.73 48.38,61.73 48.58,61.93 48.64,61.93 49.01,62.3 | 48.57,62.79 48.57,62.74 49.01,62.3 | 49.01,62.3 49.1,62.21 | 46.84,62.02 46.75,62.02 | 46.75,62.02 46.7,61.98 46.66,62.01 46.56,62.01 46.56,63.26 46.55,63.27 46.48,63.27 46.37,63.16 46.37,61.48 46.21,61.31 46.21,63.14 48.47,65.39 49.55,65.39 | 39.38,55.87 38.79,56.46 37.99,56.46 35.55,54.02 35.55,47.66 35.79,47.42 35.81,47.42 35.88,47.5 | 27.02,48.67 26.98,48.7 | 26.98,48.7 26.17,48.7 26.07,48.6 26.07,46.12 27.66,44.53 34.16,44.53 37.33,47.7 37.33,53.62 37.73,54.02 | 26.98,48.7 26.98,48.2 26.96,48.17 | 42.86,52.57 42.09,53.34 42.09,54.07 41.5,54.66 38.58,54.66 38.62,54.7 42.3,54.7 42.08,54.49 41.83,54.49 41.86,54.52 41.86,55.21 41.49,55.58 | 44.86,48.24 45.01,48.38 45.95,48.38 45.78,48.21 45.37,48.21 45.9,47.67 | 45.9,47.67 46.17,47.41 46.93,47.41 47.05,47.28 | 47.05,47.28 47.05,46.37 46.99,46.44 46.95,46.44 46.92,46.46 46.92,46.66
  Bottom 0.254: 46.92,47.02 46.92,46.66 | 46.92,46.66 47.45,46.13 47.45,38.36 48.07,37.74 47.82,37.74 47.58,37.98 45.71,37.98 45.34,37.6 45.13,37.6 45.03,37.7 45.07,37.7 45.82,38.45 45.81,38.45 45.8,38.46 44.61,37.28 44.51,37.28 | 56.45,37.7 56.89,37.7 57.48,38.3 57.48,37.16 | 57.48,37.16 56.94,36.61 56.94,36.36 57.45,35.85 | 57.48,37.16 57.52,37.16 57.6,37.08 | 36.66,38.29 36.94,38.29 37.48,37.75 37.48,36.98 | 37.48,36.98 37.48,36.39 36.95,35.87 | 37.4,37.08 37.4,37.06 37.48,36.98 | 45.67,46.99 45.74,47.06 45.74,47.38 | 45.74,47.38 45.74,47.51 45.9,47.67 | 44.15,49.07 44.79,48.44 46.93,48.44 47.45,47.91 47.45,45.77 47.25,45.97 47.25,47.28 47.05,47.28 | 42.09,54.92 42.09,48.97 43.73,47.33 45.7,47.33 45.74,47.38 | 35.43,39.77 35.43,40.05 35.92,40.55 35.92,39.65 35.85,39.58 | 35.85,39.58 35.42,39.14 35.42,39.1 35.92,38.61 | 36.18,39.58 35.85,39.58 | 52.94,37.54 52.94,37.57 53.25,37.26 53.65,37.26 53.74,37.17 54.1,37.17 | 54.2,37.08 54.27,37.08 54.93,37.74 55.09,37.74 | 57.72,67.89 57.88,67.72 57.88,67.61 57.92,67.61 57.92,67.38 | 57.72,67.89 57.12,68.48 | 33.77,34.6 32.45,34.6 32.23,34.38 32.23,34.06 32.51,33.78 32.8,33.78 32.91,33.89 32.91,34.09 32.73,34.09 32.66,34.16 | 33.77,34.6 34.06,34.31 | 33.29,34.48 33.41,34.6 33.77,34.6 | 33.77,34.6 35.92,34.6 | 33.77,34.6 | 54.51,34 54.3,33.79 53.81,33.79 53.57,34.03 53.57,34.37 53.78,34.59 56.8,34.59 | 56.8,34.59 57,34.59 57.13,34.72 | 56.71,34.42 56.8,34.5 56.8,34.59 | 57.46,40.49 57.25,40.49 56.95,40.19 56.95,38.98 57.25,38.69 57.25,38.16 56.92,37.83 57.41,37.83 57.69,38.1 57.69,38.25 56.87,39.07 56.97,39.07 57.78,38.26 57.78,36.18 57.45,35.85
  Bottom 0.254: 56.79,36.42 57.38,35.83 57.43,35.83 57.45,35.85 | 58.79,68.61 58.79,68.33 58.09,68.33 58.23,68.19 | 58.23,68.19 58.4,68.19 | 58.03,69.53 58.12,69.62 58.56,69.62 60.7,67.47 60.7,67.42 | 60.7,67.42 60.61,67.32 | 60.68,67.32 60.7,67.34 60.7,67.42 | 58.15,69.48 58.29,69.62 | 58.29,69.62 58.35,69.62 | 58.38,69.62 58.54,69.62 | 58.54,69.62 60.75,67.41 | 58.54,69.62 58.5,69.58 58.5,69.47 | 46.75,62.02 47.17,62.44 47.17,63 47.15,63.01 47.15,63.04 46.99,63.04 46.68,63.35 | 47.53,63.68 47.2,63.36 46.67,63.36 46.68,63.35 | 46.68,63.35 46.68,62.24 | 58.65,68.69 58.23,68.28 | 58.23,68.28 58.19,68.24 53,68.24 | 58.23,68.19 58.23,68.28 | 61.86,58.65 61.86,58.68 61.9,58.72 61.82,58.8 61.72,58.8 | 61.72,58.8 60.03,58.8 59.98,58.75 59.98,58.71 60.13,58.56 61.87,58.56 61.92,58.62 61.92,58.7 61.83,58.8 | D4.A 61.72,58.8 | 53.35,69.04 53.2,69.04 | 53.2,69.04 53.13,69.04 | 56.43,69.44 56.43,69.28 56.2,69.04 | 60.34,66.92 60.34,67.09 | 60.34,67.09 D1.A | 50.8,66.88 50.8,67.75 51.96,68.91 51.96,70.67 54.02,70.67 55.19,69.49 54.95,69.49 54.3,70.14 54.3,69.89 | 54.3,69.89 54.61,69.59 | 54.3,69.89 54.3,69.72 54.2,69.62 | 57.81,67.94 57.81,67.99 | 57.65,68.17 57.81,68.01 57.81,67.99 | 57.81,67.99 57.72,67.89 | 53.1,69.28 53.1,69.14 53.2,69.04
  Bottom 0.305: 56.71,34.07 56.71,34.42 57.67,35.38 57.79,35.38 | 35.28,34.37 35.3,34.37 35.99,35.06 36.3,34.74 36.3,34.72 36.44,34.72
  Bottom 0.381: 57.92,69.04 57.92,67.73 57.92,67.38 57.92,60.86 60.11,58.67 D4.A
  Bottom 1.016: C7.2 54.01,34.16 IC3.1 | C6.2 32.66,34.16 IC2.1
  Bottom 1.27: D5.C 25.8,49.88 Q1.S | 53.35,69.04 56.2,69.04 57.92,69.04 58.38,69.04 D1.A | IC3.8 57.79,39.52 | 57.79,39.52 57.79,37.08 57.79,35.38 IC3.1 | D6.C 47.46,54.41 Q2.S | C11.1 36.18,39.58 36.44,39.83 | 54.1,37.17 54.2,37.08 | C12.1 57.74,39.58 57.79,39.52 | C14.+ 47.57,61.77 47.47,61.88
  Bottom 1.422: IC2.8 36.44,39.83 36.44,37.01 | 36.44,37.01 36.44,34.72 IC2.1 36.38,34.23 | 37.4,37.08 37.24,37.08 37.17,37.01 36.44,37.01 | 57.73,34.23 IC3.1
  Bottom 1.778: 57.22,37.08 54.2,37.08 46.57,37.08 37.4,37.08
  Bottom 2.032: 53.35,69.04 47.8,63.49 47.8,61.88 42.98,57.06 | 42.98,57.06 42.98,49.33 45.32,46.99 | 45.32,46.99 46.54,45.77 46.54,37.92 46.4,37.77 | 42.98,57.06 41.49,55.58 38.37,55.58 36.45,53.65 36.45,48.07 35.88,47.5 33.8,45.42 28.04,45.42 26.96,46.5 26.96,48.17 Q1.S | Q2.S 45.67,46.99 45.32,46.99
  Bottom 2.54: F1.2 53.1,69.28
ALARM_LED-
  Top 0.254: 87.09,9.72 87.09,9.77 87.14,9.81 | 87.05,9.63 87.12,9.55 88.87,9.55 90.07,10.75 90.07,13.24 90.02,13.29 89.87,13.29 89.76,13.18 89.76,10.92 88.71,9.87 87.19,9.87 87.14,9.81 | R7.2 87.14,9.81
  Top 0.406: I/O_1.ALARM_LED- 89.91,10.83 88.75,9.68 R7.2
ALARM_OUT
  Bottom 0.254: R3.2 46.64,15.81 46.7,15.88
  Bottom 0.406: IC1.6 46.19,15.82 R3.2 | 46.7,15.37 46.7,15.88 46.7,16.44 46.21,16.93 46.21,16.13 46.52,15.81 46.52,16.26 46.44,16.34
CRYSTAL_A
  Bottom 0.254: 58.47,13.38 58.89,13.38 | 58.89,13.38 59.02,13.38 59.05,13.35 59.05,12.87 59.08,12.84 59.08,13.24 59.05,13.28 | 58.82,13.05 58.89,13.12 58.89,13.38 | 54.2,17.74 54.02,17.92 54.02,19.1 53.85,19.27 53.81,19.27 | 53.81,19.27 53.68,19.13 53.68,18.13 54.17,17.64 | 54.02,19.26 53.81,19.26 | 53.81,19.26 53.76,19.26 53.69,19.19 | IC1.9 53.81,19.26 | 53.81,19.26 53.81,19.27 | 60.52,10.19 60.66,10.33 60.66,11.37 59.13,12.9 59.13,13.36 58.93,13.16 58.93,12.88 60.32,11.49 60.32,10.28 60.4,10.19 60.58,10.19 60.65,10.27 | 60.51,10.18 60.52,10.19 | 60.52,10.19 60.52,10.21 60.51,10.22 C1.1 60.44,11.32 60.5,11.38
  Bottom 0.356: IC1.9 53.81,18.07 58.82,13.05 | 58.82,13.05 60.5,11.38 | T1.1 58.82,13.1 58.82,13.05
CRYSTAL_B
  Bottom 0.254: 63.44,14.04 63.44,14.2 63.68,14.44 65.14,14.44 65.2,14.51 65.2,14.55 65.13,14.62 63.29,14.62 63.16,14.75 63.16,14.66 63.38,14.44 | 63.38,14.44 63.38,13.87 63.4,13.84 63.4,14.1 63.73,14.43 | 63.41,14.43 63.44,14.41 63.47,14.41 63.44,14.44 63.38,14.44 | 56.36,19.28 56.3,19.28 56.27,19.25 56.27,17.78 56.33,17.72 56.33,19.28 56.34,19.29 56.5,19.13 56.5,17.77 56.64,17.64 | 56.64,17.64 56.69,17.58 56.69,17.49 56.66,17.52 | 58.02,16.39 57.93,16.39 56.4,17.91 56.4,17.78 56.66,17.52 | 56.66,17.52 56.66,17.46 | 56.71,17.36 56.64,17.44 | 56.64,17.44 56.48,17.6 56.47,17.6 56.21,17.85 56.21,19.26 56.26,19.3 56.45,19.3 56.51,19.24 56.51,17.78 56.78,17.51 | 56.64,17.64 56.64,17.44 | 65.04,14.51 65.16,14.51 65.18,14.53 | 61.16,16.41 61.56,16.41 63.27,14.7 65.1,14.7 65.19,14.61 65.19,14.54 65.18,14.53 | 65.18,14.53 T1.2
  Bottom 0.356: IC1.10 56.35,17.77 56.66,17.46 57.76,16.36 61.48,16.36 63.41,14.43 | 63.41,14.43 63.41,11.71 C2.1 | T1.2 63.5,14.53 63.41,14.43
D4
  Top 2.032: R1.1 36.56,48.73 Q1.G
  Bottom 1.27: D5.A 33.2,49.88 Q1.G
FLOW_LPM
  Bottom 0.254: 60.35,24.6 59.8,24.6 59.03,25.36 59.03,26.81 58.93,26.91 58.79,26.91 58.76,26.88 58.76,25.36 59.58,24.54 | 59.58,24.54 59.78,24.54 | 59.64,24.57 59.61,24.57 59.58,24.54 | 77.57,24.56 77.69,24.56 77.75,24.51 | 77.75,24.51 77.99,24.27 78.11,24.27 78.37,24.52 | 78.04,24.51 77.75,24.51
  Bottom 0.356: IC1.18 58.89,25.32 59.64,24.57 78.1,24.57 | 78.1,24.57 78.04,24.51 FLOW.2 | I/O_4.FLOW_A 84.4,32.52 82.06,30.18 82.06,26.85 79.78,24.57 78.1,24.57
GND
  Top 0.254: 48.98,26.36 48.98,25.37 48.99,25.36 | 48.99,25.36 48.5,25.36 48.5,25.61 48.51,25.63 48.51,26.61 48.58,26.68 | 48.82,26.75 IC1.22 | 51.08,17.95 51.07,17.95 51.07,20.5 51.43,20.5 51.48,20.44 51.48,17.82 | R24.2 46.67,30.7 46.79,30.82 | 46.79,30.82 47.9,30.82 | 46.79,30.82 46.75,30.82 | 48,30.56 47.97,30.54 46.7,30.54 46.7,30.53 46.69,30.53 | 47.33,29.39 46.62,29.39 46.6,29.4 47.19,29.4 47.21,29.43 | 30.16,34.29 30.16,35.4 30.13,35.44 29.92,35.44 29.87,35.38 29.87,35.25 | 29.87,35.25 29.87,34.36 | 29.87,34.36 C6.1 30.02,34.22 30.06,34.26 30.06,35.27 30.02,35.3 29.92,35.3 29.87,35.25 | 29.87,34.36 29.87,34.29 | 46.93,30.55 46.66,30.55 | 46.66,30.55 46.61,30.61 46.61,30.72 46.69,30.8 46.91,30.8 46.91,30.81 | 46.66,30.55 46.67,30.55 46.67,30.52 46.68,30.5 | 46.69,30.5 46.68,30.5 | 46.68,30.5 46.66,30.5 | IC1.22 | IC1.22 48.58,26.68 | 48.58,26.68 48.62,26.68 | 48.62,26.68 48.67,26.68 48.64,26.7 48.61,26.7 48.62,26.69 48.62,26.68 | 48.84,26.01 48.86,26.01 48.99,26.14 48.99,26.62 48.8,26.81 48.68,26.81 48.55,26.68 48.57,26.68 48.58,26.68 | 48.99,25.36 48.99,26.46 48.75,26.7 48.75,26.54 48.64,26.43 48.64,25.64 48.73,25.55 48.73,26.29 48.85,26.42 | 46.65,29.42 46.64,29.42 46.62,29.4 | 46.62,29.4 46.64,29.37 47.13,29.37 47.11,29.4 46.62,29.4
  Top 0.381: R24.2 46.67,30.7
  Top 0.406: 32.79,60.91 32.79,61.42 31.73,62.48 32.16,62.48 32.4,62.24 33.19,62.24 33.57,62.62 33.71,62.62 33.82,62.5 33.82,62.34 32.96,61.49 32.96,59.8 34.04,58.72 33.59,58.72 32.79,59.53 32.44,59.53 31.69,58.78 32.05,58.78 32.3,59.04
  Top 1.016: 32.8,62.68 32.8,58.41 32.79,58.4
  pour Top (isolate 0.61): 91.64,1.68 8.39,1.66 8.39,4.54 arc90 4.52,8.34 1.66,8.34 1.67,71.64 4.74,71.64 arc90 8.38,75.29 8.38,78.34 91.57,78.34 91.63,75.43 arc90 95.38,71.64 98.33,71.65 98.34,8.36 95.39,8.37 arc90 91.64,4.63
I2C_SCL
  Top 0.254: 21.58,29.07 21.64,29.07 21.9,28.81 22.04,28.81 | 22.04,28.81 22.29,29.06 | 21.96,29.11 22.04,29.03 22.04,28.81 | 33.48,26.81 33.51,26.81 33.56,26.87 33.42,27.01 | 33.42,27.01 31.52,27.01 29.34,29.19 28.94,29.19 | IC1.28 33.42,26.91 33.42,27.01 | 10.24,27.79 10.18,27.85 | 10.18,27.85 9.99,28.04 8.78,28.04 7.96,28.86 | 7.96,28.86 7.96,28.97 | 7.96,28.86 7.96,28.41 8.76,27.61 10.01,27.61 10.13,27.73 10.13,27.77 | I/O_3.SCL_2 10.13,27.8 10.18,27.85
  Top 0.381: 21.94,29.12 29.22,29.12 31.5,26.84 IC1.28 | 21.94,29.12 19.63,29.12 13.51,35.25 9.21,35.25 8.01,34.06 8.01,28.65 8.86,27.8 I/O_3.SCL_2 | R13.1 21.96,29.11 21.94,29.12
  Top 0.406: I/O_3.SCL_2 I/O_3.SCL_1
I2C_SDA
  Top 0.254: 30.01,26.3 30.01,26.5 30,26.51 | 30.14,26.43 30.01,26.3 | 30.01,26.3 30.01,26.04 30.04,26.02 30.61,26.02 30.61,25.99 30.64,25.96 | 36.04,26.9 36.26,26.69 36.26,25.47 35.37,24.59 34.7,24.59 34.82,24.7 35.15,24.7 35.89,25.45 35.89,26.81 36.02,26.94 | 36.02,26.94 36.11,26.94 36.26,26.79 | IC1.27 36.03,26.93 36.02,26.94 | 30.91,25.69 30.71,25.88 30.64,25.96 | 30.64,25.96 30,25.96
  Top 0.381: 30.14,26.43 28.2,28.38 26.04,28.38 22.61,24.94 21.13,24.94 15.73,30.34 I/O_3.SDA_1 | 30.14,26.43 31.92,24.65 35.29,24.65 36.03,25.39 IC1.27 | R14.2 30.14,26.13 30.14,26.43
  Top 0.406: I/O_3.SDA_2 I/O_3.SDA_1
N$1
  Bottom 0.381: S2.3 67.08,3.74 77.84,3.74 80.22,3.74 R11.1
N$4
  Bottom 0.254: 72.27,64.73 72.27,64.66 72.21,64.61 72.18,64.58 72,64.58 | 71.8,64.7 71.88,64.7 71.99,64.59 | 71.99,64.59 72,64.58 | 72,64.58 72.18,64.4 72.27,64.4 72.54,64.66 | 72.38,64.53 72.36,64.53 72.19,64.36 71.99,64.56 | 71.99,64.56 71.88,64.67 | 71.99,64.59 71.99,64.56
  Bottom 0.381: M1.G 74.75,63.22 73.25,64.73 72.27,64.73 66.63,64.73 65.05,63.15 65.05,60.98 D4.C | R30.1 72.21,64.61
N$7
  Bottom 0.254: 57.72,29.25 57.72,29.04 57.84,28.91 58.13,28.91 | 55.05,28.95 54.85,28.95 54.81,28.99 | 54.81,28.99 54.19,29.61 | 54.57,28.91 54.81,28.91 54.81,28.99
  Bottom 0.61: 58.2,28.98 58.13,28.91
  Bottom 1.016: L1.1 70.51,36.01 63.42,28.91 58.13,28.91 54.57,28.91 53.81,28.16 IC1.20 53.81,30.68 C8.1
N$8
  Bottom 0.254: 95.32,57.14 95.29,57.14 95.24,57.19 95.24,58.61 95.69,59.06 95.69,58.83 95.4,58.53 95.4,57.55 95.37,57.52 95.34,57.49 R18.2
  Bottom 0.406: PWR.K 95.7,57.53 R18.2
N$10
  Top 0.254: 69.77,5.66 69.77,5.25 67.71,3.19 | 67.71,3.19 67.59,3.07 | 67.71,2.99 67.71,3.19 | 52.5,3.02 51.63,3.02 49.99,4.67 49.99,4.62 50.12,4.49 50.12,5.88 | 50.12,5.88 50.12,6.28 50.06,6.34 49.97,6.34 49.92,6.29 49.92,4.42 50.16,4.19 | P1.2 50,5.99 50.12,5.88
  Top 0.381: R4.1 69.79,10.36 69.79,5.08 67.71,2.99 51.44,2.99 50,4.44 P1.2
N$11
  Bottom 0.254: 40.62,42.53 40.62,42.45 | 40.62,42.45 40.76,42.31 | 40.76,42.31 40.76,41.8 40.74,41.78 | 40.32,43.1 40.92,42.51 40.95,42.51 | 39.93,41.92 39.01,41.92 | 39.01,41.92 39,41.94 39.97,42.91 | 39.97,42.91 39.98,42.91 | 39.97,42.91 39.88,42.91 39.12,42.15 39.27,41.99 | 40.62,42.31 40.21,42.73 | 40.21,42.73 39.72,42.73 | 40.21,42.73 41,42.73 41.06,42.79 | 40.76,42.31 40.95,42.51 | 39.86,43.48 40.99,42.34 40.99,42.24 41.21,42.46 41,42.46 40.95,42.51 | 39.63,42.44 39.92,42.44 | 39.92,42.44 40.19,42.44 40.25,42.49 | 40.21,42.73 39.92,42.44 | 40.25,42.49 40.25,42.58 | 40.65,42.28 40.62,42.31 | 40.62,42.31 40.62,42.45 | 39.01,41.92 39.58,42.49 40.25,42.49 | 38.65,41.85 38.65,42.23 39.57,43.15 39.57,42.95 39.08,42.46 38.89,42.46 38.58,42.16 38.58,41.98 38.52,41.92 41.86,41.92 41.98,42.04 41.98,42.07 41.06,42.99 41.06,42.79 | 41.06,42.79 41.39,42.46 41.58,42.46 42.02,42.02 42.02,41.67 41.97,41.62
  Bottom 1.27: IC2.7 40.74,41.78 IC2.6
  Bottom 2.032: R1.2 40.25,46.34 40.25,42.58
N$12
  Bottom 0.254: 52.33,49.52 53.23,50.42 53.87,50.42 54.12,50.17 | 54.12,50.17 54.76,49.53 | 52.81,48.77 Q2.G | 53.7,49.95 53.59,49.83 53.59,49.81 53.95,50.17 54.12,50.17
  Bottom 0.381: 52.17,48.27 52.48,47.95 57.47,47.95 60.8,51.28 60.43,51.66 60.13,51.66 60.13,51.8 R2.1
  Bottom 1.27: D6.A 53.7,49.95 Q2.G
  Bottom 2.032: Q2.G 57.12,48.78 R2.1
N$13
  Bottom 0.254: 61.62,41.78 61.62,42.55 61.6,42.58 | 60.73,42.05 60,42.05 59.95,42.1 59.95,42.2 60.65,42.91 | 60.65,42.91 60.72,42.98 60.72,42.83 | 60.72,42.83 60.72,42.77 60.37,42.42 60.2,42.42 59.86,42.09 59.86,41.88 59.95,41.78 61.43,41.78 | 63.38,41.88 63.39,41.88 62.37,42.91 | 62.37,42.91 60.65,42.91 | 62.37,42.91 62.46,42.91 63.29,42.08 62.9,42.08 62.49,42.48 | 60.64,47.42 60.92,47.42 62.5,45.84 62.5,42.67 61.65,41.83 60.75,41.83 60.18,42.4 60.7,42.91 | 60.7,42.91 60.7,45.12 59.58,46.24 | 60.7,42.91 60.79,42.83 60.72,42.83
  Bottom 1.27: IC3.7 61.43,41.78 61.62,41.78 IC3.6
  Bottom 2.032: 61.6,42.51 61.6,42.58 61.6,45.48 R2.2
N$14
  Bottom 0.254: 94.22,66.34 94.78,66.34 95.61,67.17 95.61,68.38 | 95.61,68.38 95.61,68.49 95.71,68.59 95.82,68.49 95.82,68.41 | 95.82,68.41 95.82,68.12 | FUSE.K 95.61,68.38 | 95.86,68.48 95.86,68.38 | 95.86,68.38 95.86,67.08 95.05,66.27 92.19,66.27 92.1,66.19 | 95.82,68.41 95.86,68.38
  Bottom 0.381: M1.S 81.84,63.23 89.13,63.23 92.24,66.34 95.01,66.34 95.7,67.03 FUSE.K
N$16
  Top 0.254: 85.37,45.25 85.26,45.15 83.2,45.15 82.86,44.8 | 82.86,44.8 82.86,45.32 82.82,45.36 | 82.44,45.74 82.82,45.36 | 82.82,45.36 85.35,45.36 85.42,45.29 85.42,45.25 | 85.42,45.25 85.32,45.16 85.18,45.16 85.14,45.2 82.74,45.2 80.14,47.79 80.14,49.94 80.21,50 80.31,50 80.4,49.91 80.4,47.83 80.28,47.71 | R27.2 85.4,45.27 85.42,45.25 | 82.83,44.45 82.83,44.65 82.98,44.8 | 82.98,44.8 83.42,45.23 | 82.86,44.8 82.98,44.8
  Top 0.406: N4.D 80.26,47.81 82.8,45.27 | 82.8,45.27 N6.G N8.G | R27.2 82.8,45.27
N$17
  Top 0.254: IC1.21
  Top 0.508: C9.1 60.74,31.88 60.17,32.45 45.28,32.45 44.2,31.38 44.2,29.76 45.57,28.39 50.84,28.39 51.27,27.96 IC1.21
N$19
  Bottom 0.254: 35.54,13.12 35.64,13.12 35.98,12.79 36.06,12.79 36.34,13.06 36.05,13.06 36,13.02 | R15.2 27.04,19.25 27.17,19.11 | 27.17,19.11 27.17,17.92 | 27.17,19.11 27.17,19.16 27.08,19.25 | 27.08,19.25 26.98,19.25 26.94,19.21 26.94,18.01 27.21,17.74 | R15.2 27.08,19.24 27.08,19.25
  Bottom 0.356: R15.2 27.04,17.98 31.91,13.11 35.91,13.11 | R3.1 39.29,13.11 35.91,13.11 | N3.G 36,13.02 35.91,13.11
N$20
  Bottom 0.254: 72.88,9.7 72.88,9.75 72.98,9.85 75.03,9.85 75.09,9.78 | 75.09,9.78 75.34,9.53 75.34,9.38 | 75.34,9.38 75.56,9.16 | 75.34,9.38 75.17,9.55 72.93,9.55 72.88,9.6 72.88,9.81 | 72.88,9.81 72.92,9.85 72.93,9.85 | R10.1 72.96,9.72 72.88,9.81 | 77.06,7.75 77.13,7.75 77.47,7.42 77.47,5.55 77.4,5.48 77.28,5.48 | 77.28,5.48 77.2,5.56 77.2,7.57 77.03,7.75 | S3.3 77.28,5.52 77.28,5.48 | 75.37,9.46 75.37,9.52 75.11,9.78 | 75.11,9.78 75.04,9.85 73.76,9.85 73.99,9.62 75.05,9.62 77.32,7.34 77.32,6.96 | 75.09,9.78 75.11,9.78
  Bottom 0.381: S3.3 77.34,7.47 75.13,9.68 R10.1
N$22
  Bottom 1.27: F2.1 66.35,67.12 D1.C
N$23
  Bottom 0.254: 6.7,56.79 6.75,56.79 7.12,56.42 7.12,55.96 6.87,55.71 | 6.87,55.71 6.71,55.56 | 6.87,55.92 6.75,55.8 | 6.87,55.92 6.97,56.02 6.97,56.1 6.71,55.85 6.71,55.64 6.7,55.63 | 6.87,55.92 6.87,55.71 | 6.78,55.62 6.78,55.65 6.7,55.73 6.7,55.88 | 6.78,55.62 6.56,55.39 | 6.78,55.62 7.52,56.36 7.53,56.36 | 4.87,52.71 5.12,52.97 5.12,53.92 5.05,53.99 5.05,54.07 4.68,53.7 4.68,52.88 | 4.68,52.88 4.68,52.84 4.83,52.69 4.91,52.69 5.09,52.87 | N1.D 4.76,52.88 4.68,52.88
  Bottom 0.305: 10,56.36 10,56.38 9.91,56.48 7.2,56.48 | 7.2,56.48 7.16,56.48 6.74,56.9 | 7.12,56.42 7.15,56.42 7.2,56.48
  Bottom 0.381: TX.A 6.7,56.38 | R9.2 6.7,56.38 | N1.D 4.86,53.79 6.7,55.63 6.7,55.88 6.7,56.38
N$24
  Top 0.381: N2.D 12.41,55.23 12.41,57.51 R8.2
  Bottom 0.254: 9.99,59.93 9.99,59.99 | 9.99,59.99 10.04,60.05 10.04,60.08 8.4,61.72 | 8.4,61.72 8.4,62.12 | 8.4,61.72 8.4,61.34 9.9,59.84 9.93,59.84 10.07,59.99 10.07,60.04 10.05,60.06 | 9.99,59.99 9.97,59.98 R8.2 | 6.66,68.54 6.79,68.54 8.54,66.79 8.54,65.72 8.42,65.83 8.42,66.62 6.69,68.36 | 6.69,68.36 6.65,68.4 6.65,68.52 | RX.A 6.69,68.46 6.69,68.36
  Bottom 0.381: 8.67,61.24 8.48,61.44 8.48,66.69 RX.A
  Bottom 0.406: R8.2 8.67,61.24
N$25
  Bottom 0.254: 72.22,58.74 72.18,58.74 72.11,58.67 | 72.06,58.67 72.13,58.75 72.31,58.75 72.38,58.68 72.38,57.06 73.14,56.3 79.23,56.3 80.22,57.29 80.22,57.31 80.42,57.11 80.42,57.09 79.43,56.1 72.95,56.1 72.06,57 72.06,58.62 72.11,58.67 | M1.D 72.11,58.67
  Bottom 0.381: M1.D 72.21,57.04 73.06,56.2 79.28,56.2 R17.1
N$29
  Bottom 0.381: E1.A 29.56,9.98 44.95,9.98 R6.2
N$36
  Top 0.381: N5.D R28.1
  Bottom 0.254: 90.2,45.26 90.2,45.36 90.34,45.51 91.73,45.51 92.89,44.36 92.89,41.57 92.69,41.77 92.69,44.22 91.74,45.16 91.73,45.15 90.64,45.15 90.39,45.15 | 90.39,45.15 90.23,45.15 90.16,45.22 90.16,45.4 90.25,45.49 90.33,45.49 90.35,45.47 | R28.1 90.39,45.15
  Bottom 0.381: R28.1 91.8,45.27 92.79,44.29 92.79,41.64 N7.G N9.G
N$100
  Top 0.254: 32.74,7.41 32.75,7.4 32.79,7.4 32.85,7.46 32.85,9.07 33.59,9.81 33.59,11.63 33.54,11.68 33.38,11.68 33.34,11.64 33.34,9.96 32.6,9.23 32.6,7.46 32.68,7.39 32.7,7.39 | 32.7,7.39 32.85,7.39 | S1.3 32.7,7.4 32.7,7.39
  Top 0.381: S1.4 44.96,1.75 77.17,1.75 79.78,4.36 79.78,7.39 R7.1
  Top 0.406: S1.3 32.75,9.19 33.46,9.89 N3.D
  Bottom 0.254: 21.85,11.47 21.92,11.54 22.44,11.54 22.5,11.61 | 22.5,11.61 22.5,12.02 | 22.5,11.61 22.25,11.85 22.25,11.87 | 23.6,10.41 23.65,10.37 24.15,10.37 | 24.15,10.37 24.22,10.29 24.22,9.9 | 24.15,10.37 24.1,10.31 24.1,10.24 | 35.45,7.43 35.59,7.43 35.93,7.77 36.1,7.77 | 36.1,7.77 36.36,7.51 | 36.03,7.46 36,7.48 36.02,7.51 36.36,7.51 | 35.72,8.45 35.79,8.38 | 35.79,8.38 35.89,8.28 35.89,7.65 36.06,7.48 36.63,7.48 | 35.79,8.38 35.91,8.38 36.1,8.19 | 36.1,8.19 36.1,7.77 | 36.36,7.51 36.37,7.49 | 25.59,15.12 25.59,15.28 25.78,15.48 27.26,15.48 27.27,15.47 27.27,15.39 D3.A | 25.59,15.12 25.37,14.9 | 25.59,15.12 25.71,15.24 27.25,15.24 27.32,15.32 27.32,15.43 27.27,15.48 | 19.74,7.55 19.85,7.65 19.85,9.4 19.82,9.42 19.82,9.51 19.57,9.25 19.57,7.64 19.65,7.56 19.7,7.56 19.7,7.59 B1.- 19.69,7.67 19.87,7.84 19.87,9.32 21.96,11.41 22.64,11.41 22.65,11.4 22.65,12.24 22.76,12.36 | 35.26,7.43 35.51,7.43 35.8,7.72 35.8,8.27 34.99,9.08 35,9.09 35.2,9.09 36.12,8.16 | 36.1,8.19 36.12,8.16 | 36.12,8.16 36.12,7.85 | 35.54,8.66 35.63,8.66 36.17,8.12 36.17,7.77 36.2,7.77 36.47,7.5 35.17,7.5 35.12,7.45 35.44,7.45 35.45,7.46 | 35.45,7.46 35.88,7.89 | 35.45,7.46 35.7,7.46
  Bottom 0.381: 23.88,10.14 22.25,11.77 22.25,11.87 | 22.25,11.87 19.69,9.3 B1.- | 22.25,11.87 25.76,15.38 D3.A | E1.K 24.1,10.24 24,10.14 23.88,10.14 | 23.88,10.14 24.9,9.12 35.08,9.12 36,8.21 36,7.48 | S1.4 36.03,7.46 35.7,7.46 S1.3
ONE_WIRE
  Bottom 0.254: 14.78,18.59 15.17,18.2 15.17,18.57 | 33.16,13.82 33.16,13.91 33.4,14.16 33.54,14.16 33.76,13.94 | 33.76,13.94 33.78,13.91 | 33.41,13.85 33.5,13.94 33.76,13.94 | 41.1,19.2 41.1,19.25 41.1,19.26 | 41.1,19.26 41.05,19.26 39.15,17.36 38,17.36 | 38,17.36 37.91,17.27 | IC1.4 41.11,19.25 41.1,19.26 | 37.64,16.87 37.95,17.18 | 37.95,17.18 38.17,17.18 | 38.17,17.18 39.15,17.18 39.59,17.62 39.43,17.62 39.21,17.4 38.04,17.4 37.86,17.22 | 38,17.36 38.17,17.18 | 37.69,17.02 37.8,17.02 37.95,17.18 | 15.2,16.36 15.2,16.24 | 6.8,12.4 Y1.D
  Bottom 0.305: 15.2,15.41 15.2,16.24 | 15.18,16.26 15.2,16.24 15.2,16.27 | 15.15,18.22 15.15,15.51 13.79,14.16 12.69,14.16 | 13.67,14.18 7.05,14.18 6.68,13.8 6.68,12.52 6.8,12.4 6.98,12.58 6.98,13.54 7.59,14.16 7.82,14.16 | 15.17,18.2 15.15,18.22 | 15.15,18.22
  Bottom 0.356: I/O_2.DQ_1 15.17,18.57 | 15.17,18.57 15.18,18.59 15.18,16.26 15.18,15.38 13.95,14.15 7.38,14.15 6.8,13.57 Y1.D | 33.41,13.85 34.55,13.85 38,17.3 39.19,17.3 IC1.4 | 33.41,13.85 32.58,13.85 28.96,17.46 28.96,19.66 27.91,20.7 17.4,20.7 15.27,18.57 15.17,18.57 | R16.1 33.46,13.89 33.41,13.85
  Bottom 0.406: I/O_2.DQ_2 I/O_2.DQ_1
POST_FUSE
  Bottom 0.254: 72.01,52.63 72.01,53.22 72.06,53.27 72.46,53.27 72.38,53.34 71.29,53.34 71.27,53.36 71.27,53.46 72.71,53.46 73.02,53.15 73.02,51.7 | 72.01,52.63 72.44,52.2 72.44,52.24 | 72.44,52.24 72.87,52.67 72.96,52.67 72.97,52.66 72.97,51.88 73.01,51.84 | 73.01,51.84 73.01,52.63 72.97,52.67 | 71.98,52.3 72.01,52.34 72.01,52.63 | 72.96,52.85 72.96,52.05 73.21,51.8 | 73.21,51.8 73.55,51.45 73.55,49.01 | 73.01,51.84 73.06,51.8 73.21,51.8 | 72.35,52.48 72.4,52.48 | 72.4,52.48 72.69,52.48 72.8,52.37 | 72.44,52.24 72.4,52.28 72.4,52.48 | 72.28,51.98 72.73,51.98 73.02,51.7 | 73.05,51.66 73.02,51.7
  Bottom 1.27: 71.98,52.3 73.04,51.23 V1.VI | C3.1 71.98,52.6 71.98,52.3 | F2.2 69.8,60.17 69.8,54.48 71.98,52.3
PSU_RPM
  Bottom 0.254: 77.27,20.27 77.27,20.18 77.85,19.61 | 77.85,19.61 77.97,19.48 78.12,19.48 78.43,19.79 | 78.04,19.89 78.04,19.8 77.94,19.7 | 77.94,19.7 77.85,19.61 | 78.52,19.88 78.21,19.57 77.98,19.57 77.98,19.66 77.94,19.7 | 77.5,20.05 80.41,20.05 | 80.41,20.05 80.44,20.09 | 80.41,20.05 80.32,19.96 80.32,19.92 | 87.34,30.13 87.46,30.01 87.46,29.94 87.32,29.8 85.39,29.8 84.1,28.51 84.1,28.08 84,27.98 84,28.71 85.41,30.12 87.31,30.12 87.43,30.01 87.43,29.96 87.41,29.98 87.41,29.99 87.4,29.98 I/O_4.PSU | 56.37,26.92 56.48,26.81 56.48,25.32 56.36,25.44 56.36,26.91 56.27,26.82 56.28,26.81 | 56.28,26.81 56.28,25.31 56.67,24.91 | IC1.19 56.28,26.84 56.28,26.81
  Bottom 0.356: IC1.19 56.35,25.32 57.87,23.8 73.72,23.8 77.61,19.92 78.01,19.92 | I/O_4.PSU 85.4,29.98 84.05,28.62 84.05,23.64 80.32,19.92 78.01,19.92 | PSU.2 78.04,19.89 78.01,19.92
PUMP1_TACH
  Bottom 0.254: 86.71,53.55 86.71,53.62 86.76,53.58 86.78,53.58 | 87.05,53.58 87.1,53.52 87.24,53.52 | 86.82,53.58 86.86,53.58 87.19,53.24 87.19,53.28 86.89,53.59 86.89,53.63 87.16,53.91 | 82.81,49.94 82.81,49.88 82.8,49.87 | 82.8,49.87 82.86,49.87 82.93,49.94 82.93,51.18 83.43,51.68 83.43,51.8 | 82.67,49.95 82.76,49.86 82.8,49.86 | 87.3,53.09 87.3,52.94 87.24,52.88 | 87.19,52.75 87.3,52.64 87.24,52.64 87.24,52.65 | 82.8,49.86 82.84,49.86 82.84,49.88 N4.G 82.77,49.95 82.67,49.95 82.63,49.99 82.63,51.21 83.26,51.83 86.6,51.83 | 82.8,49.86 82.8,49.87 | 86.6,51.83 86.78,52.01 86.8,52.01 86.82,51.99 87.3,52.47 87.3,52.86 87.3,52.87 87.3,52.26 86.73,51.69 85.51,51.69 85.4,51.79 | 41.21,65.77 41.26,65.81 | 41.26,65.81 42.46,67.02 42.46,68.42 41.44,67.4 41.44,66.15 42.3,67.02 42.3,67.21 42.25,67.26 42.25,68.06 | 42.25,68.06 41.61,67.42 41.61,66.5 42.27,67.17 42.27,67.29 42.07,67.49 42.07,67.71 41.77,67.41 | 41.77,67.41 41.71,67.34 41.67,67.34 41.82,67.19 41.82,66.92 42.17,67.28 42.17,67.34 42.1,67.41 41.77,67.41 | 41.77,67.41 41.99,67.19 42.03,67.19 | PUMP_2.TACH_B 41.24,65.81 41.26,65.81 | 42.32,68.05 42.45,67.91 42.45,67.86 | 41.13,65.68 41.19,65.68 42.45,66.94 42.45,67.86 | 42.25,68.06 42.45,67.86 | 86.6,51.83 86.65,51.79 86.65,51.69 86.02,51.69 86.03,51.69 85.99,51.69 85.92,51.76 | 91.31,63.37 91.31,63.53 92.65,64.88 92.58,64.95 92.55,64.95 | 97.36,68.6 97.38,68.62 97.38,69.25 97.23,69.4 | 97.23,69.4 96.31,70.33 96.01,70.33 | 95.59,70.33 96.01,70.33 | 96.01,70.33 97.29,69.05 | 97.32,69.14 97.23,69.23 97.23,69.4
  Bottom 0.381: R25.2 86.78,53.58 86.82,53.58 87.05,53.58 | N4.G 82.8,51.22 83.33,51.75 86.34,51.75 87.24,52.65 87.24,52.88 87.24,53.52 87.24,56.79 91.29,60.84 91.29,63.69 92.55,64.95 95.66,64.95 97.32,66.61 97.32,69.14 96.2,70.26 92.64,70.26 85.51,77.39 51.32,77.39 41.2,67.27 PUMP_2.TACH_B
PUMP2_TACH
  Bottom 0.254: 94.97,51.78 95.26,52.08 95.41,52.08 95.66,51.83 95.59,51.76 95.34,51.76 | 92.83,49.86 92.81,49.86 92.83,49.87 92.83,49.92 92.82,49.92 N5.G | 92.83,49.86 92.85,49.86 92.94,49.95 92.94,51.13 93.47,51.66 93.47,51.69 93.6,51.81 93.29,51.81 92.66,51.19 92.66,49.95 92.75,49.86 92.83,49.86 | 34.49,69.43 34.55,69.43 34.62,69.36 34.31,69.36 32.91,67.97 32.91,65.85 32.82,65.75 PUMP_2.TACH_A | 34.01,69.43 32.7,68.13 32.7,65.76 32.75,65.71 32.84,65.71 32.91,65.78 | 32.82,65.74 33.03,65.94 33.03,68.05 34.33,69.35 34.57,69.35 34.49,69.43 | 34.49,69.43 34.01,69.43 | 34.01,69.43 33.75,69.43 32.52,68.2 32.52,65.89 32.72,65.69 32.91,65.69 33.04,65.82 33.04,68.24 32.97,68.31 | 96.67,51.8 97.16,51.8 98.23,52.86 98.23,52.79 98.28,52.74 | 98.34,69.47 98.35,69.48 98.35,70.01 | 98.35,70.01 | 98.35,70.01 97.02,71.34 | 96.19,71.34 97.02,71.34 | 97.02,71.34 98.35,70.01 | 98.35,70.01 98.23,69.9 98.22,69.9
  Bottom 0.381: PUMP_2.TACH_A 32.8,68.08 34.1,69.38 41.79,69.38 50.72,78.31 87.11,78.31 94.15,71.28 96.84,71.28 98.22,69.9 98.28,69.84 98.28,52.74 97.28,51.75 95.35,51.75 | R26.2 95.34,51.76 95.35,51.75 | N5.G 92.8,51.16 93.39,51.75 95.35,51.75
PUMP_1_VCC_OUT
  Top 0.254: 50.88,51.19 49.11,52.97 48.73,52.97 | 48.73,52.97 45.01,52.97 41.52,56.47 38.88,56.47 37.89,57.46 37.89,61.04 37.61,61.33 | 50.08,48.92 50,48.84 50,49 | 50.08,48.92 50.58,48.92 | 50.58,48.92 50.66,48.92 50.88,49.14 50.27,49.14 50.13,49 | 50.16,48.66 50.2,48.71 | 50.2,48.71 50.88,49.39 | 50.88,51.23 49.14,52.97 48.86,52.97 | 48.86,52.97 48.73,52.97 | 48.73,52.97 48.28,52.97 | 48.73,52.97 | Q2.D 50.12,48.78 50.2,48.71 | 48.86,52.97 49.18,52.97 50.89,51.25 50.89,49.1 50.57,48.77 50.34,49 50.13,49 | 36.45,61.34 36.11,61 36.11,56.73 38.15,54.69 40.78,54.69 44.29,51.18 48.38,51.18 49.12,50.43 49.12,48.83 49.41,48.54 49.87,49 50,49 | 50,49 50.13,49 | 50.21,48.34 50.89,49.02 | 50.89,49.02 50.89,50.57 | 50.89,49.02 50.61,49.02 50.58,49 50.58,48.92 | 42.61,55.08 42.77,54.93 40.05,54.93 38.5,56.48 | 38.4,56.59 38.5,56.48 | 38.5,56.48 38.5,56.27 38.16,55.93 | 49.96,48.83 50.1,48.97 | 50.1,48.97 50.89,49.76 | 50.89,49.76 50.89,51.4 50.13,52.15 50.13,53.19 49.84,53.49 49.65,53.49 48.85,52.68 47.96,52.68 47.68,52.97 49.02,52.97 49.45,53.4 49.45,53.06 49.34,52.95 49.39,52.95 49.43,52.99 | 50.89,49.76 50.89,49.68 | 49.51,53.07 49.43,52.99 | 49.43,52.99 48.16,52.99 | 50.08,48.92 50.1,48.94 50.1,48.97
  Top 1.27: D8.C 50,65.42 50,49.3
  Top 2.032: Q2.D 50,48.84 50,49.3 50,50.82 48.74,52.08 44.65,52.08 41.15,55.58 38.52,55.58 38.16,55.93 37,57.09 PUMP_2.12V_B
PUMP_2_VCC_IN